# EAGLE design v2.1 (EAGLE 9.0.0)
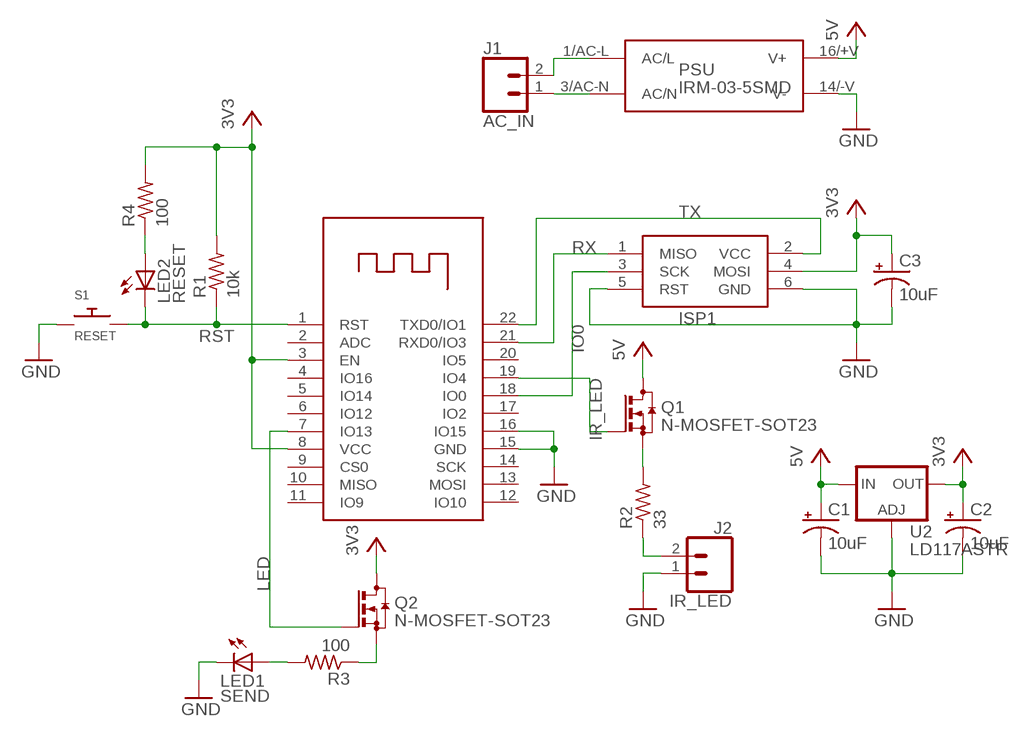
[diagram p0: schematic, sheet 1]

## Parts
C1  10uF  CPOL-US153CLV-0405  [153CLV-0405]
C2  10uF  CPOL-US153CLV-0405  [153CLV-0405]
C3  10uF  CPOL-US153CLV-0405  [153CLV-0405]
ISP1  AVRISP-6  [AVRISP]
J1  AC_IN  1X2_5MM_SCREW  [1X2_5MM_SCREW]
J2  IR_LED  1X2_5MM_SCREW  [1X2_5MM_SCREW]
LED1  SEND  LEDSML0805  [SML0805]
LED2  RESET  LEDSML0805  [SML0805]
PSU  IRM-03-5SMD  [IRM-03-5S]
Q1  N-MOSFET-SOT23  [SOT23]
Q2  N-MOSFET-SOT23  [SOT23]
R1  10k  R-US_R0805  [R0805]
R2  33  R-US_MELF0207R  [MINI_MELF-0207R]
R3  100  R-US_R0805  [R0805]
R4  100  R-US_R0805  [R0805]
S1  RESET  BUTTON  [B3F-1000]
U1  ESP-12F  [ESP-12F]
U2  LD117ASTR  [SOT223]

## Nets
3V3: C2.+ C3.+ ISP1.4(MOSI) Q2.3(D) R1.2 R4.2 U1.3(EN) U1.8(VCC) U2.4(OUT)
5V: C1.+ PSU.16/+V(V+) Q1.3(D) U2.3(IN)
AC/L: J1.2 PSU.1/AC-L(AC/L)
AC/N: J1.1 PSU.3/AC-N(AC/N)
GND: C1.- C2.- C3.- ISP1.5(RST) ISP1.6(GND) J2.1 LED1.C PSU.14/-V(V-) S1.1 S1.2 U1.15(GND) U1.16(IO15) U2.1(ADJ)
IO0: ISP1.3(SCK) U1.18(IO0)
IR_LED: Q1.1(G) U1.19(IO4)
LED: Q2.1(G) U1.7(IO13)
N$1: Q2.2(S) R3.1
N$2: LED1.A R3.2
N$3: LED2.A R4.1
N$5: Q1.2(S) R2.2
N$6: J2.2 R2.1
RST: LED2.C R1.1 S1.3 S1.4 U1.1(RST)
RX: ISP1.1(MISO) U1.21(RXD0/IO3)
TX: ISP1.2(VCC) U1.22(TXD0/IO1)
Unconnected: U1.2(ADC) U1.4(IO16) U1.5(IO14) U1.6(IO12) U1.9(CS0) U1.10(MISO) U1.11(IO9) U1.12(IO10) U1.13(MOSI) U1.14(SCK) U1.17(IO2) U1.20(IO5)

## Library data of the parts
C1-C3 = resistor:CPOL-US: POLARIZED CAPACITOR, American symbol
ISP1 = my_parts:AVRISP: AVR ISP HEADER Standard 6 pin header for AVR programming
J1 J2 = my_parts:1X2_5MM_SCREW
LED1 LED2 = led:LED: LED OSRAM: - CHIPLED LG R971, LG N971, LY N971, LG Q971, LY Q971, LO R971, LY R971 LH N974, LH R974 LS Q976, LO Q976, LY Q976 LO Q996 - Hyper CHIPLED LW Q18S LB Q993, LB Q99A, LB R99A - SideLED LS A670, LO A670, LY A670, LG A670, LP A670 LB A673, LV A673, LT A673, LW A673 LH A674 LY A675 LS A676, LA A676, LO A676, LY A676, LW A676 LS A679, LY A679, LG A679 - Hyper Micro SIDELED® LS Y876, LA Y876, LO Y876, LY Y876 LT Y87S - SmartLED LW L88C, LW L88S LB L89C, LB L89S, LG L890 LS L89K, LO L89K, LY L89K LS L896, LA L896, LO L896, LY L896 - TOPLED LS T670, LO T670, LY T670, LG T670, LP T670 LSG T670, LSP T670, LSY T670, LOP T670, LYG T670 LG T671, LOG T671, LSG T671 LB T673, LV T673, LT T673, LW T673 LH T674 LS T676, LA T676, LO T676, LY T676, LB T676, LH T676, LSB T676, LW T676 LB T67C, LV T67C, LT T67C, LS T67K, LO T67K, LY T67K, LW E67C LS E67B, LA E67B, LO E67B, LY E67B, LB E67C, LV E67C, LT E67C LW T67C LS T679, LY T679, LG T679 LS T770, LO T770, LY T770, LG T770, LP T770 LB T773, LV T773, LT T773, LW T773 LH T774 LS E675, LA E675, LY E675, LS T675 LS T776, LA T776, LO T776, LY T776, LB T776 LHGB T686 LT T68C, LB T68C - Hyper Mini TOPLED® LB M676 - Mini TOPLED Santana® LG M470 LS M47K, LO M47K, LY M47K Source: http://www.osram.convergy.de LUXEON: - LUMILED® LXK2-PW12-R00, LXK2-PW12-S00, LXK2-PW14-U00, LXK2-PW14-V00 LXK2-PM12-R00, LXK2-PM12-S00, LXK2-PM14-U00 LXK2-PE12-Q00, LXK2-PE12-R00, LXK2-PE12-S00, LXK2-PE14-T00, LXK2-PE14-U00 LXK2-PB12-K00, LXK2-PB12-L00, LXK2-PB12-M00, LXK2-PB14-N00, LXK2-PB14-P00, LXK2-PB14-Q00 LXK2-PR12-L00, LXK2-PR12-M00, LXK2-PR14-Q00, LXK2-PR14-R00 LXK2-PD12-Q00, LXK2-PD12-R00, LXK2-PD12-S00 LXK2-PH12-R00, LXK2-PH12-S00 LXK2-PL12-P00, LXK2-PL12-Q00, LXK2-PL12-R00 Source: www.luxeon.com KINGBRIGHT: KA-3528ASYC Source: www.kingbright.com
PSU = my_parts:IRM-03-5
Q1 Q2 = my_parts:N-MOSFET
R1-R4 = resistor:R-US_: RESISTOR, American symbol
S1 = my_parts:BUTTON
U1 = my_parts:ESP-12F
U2 = v-reg:LD117A?*: Low drop fixed and adjustable positive voltage regulators 1 A Source: http://www.st.com/stonline/products/literature/ds/7194/ld1117axx.pdf

## Board
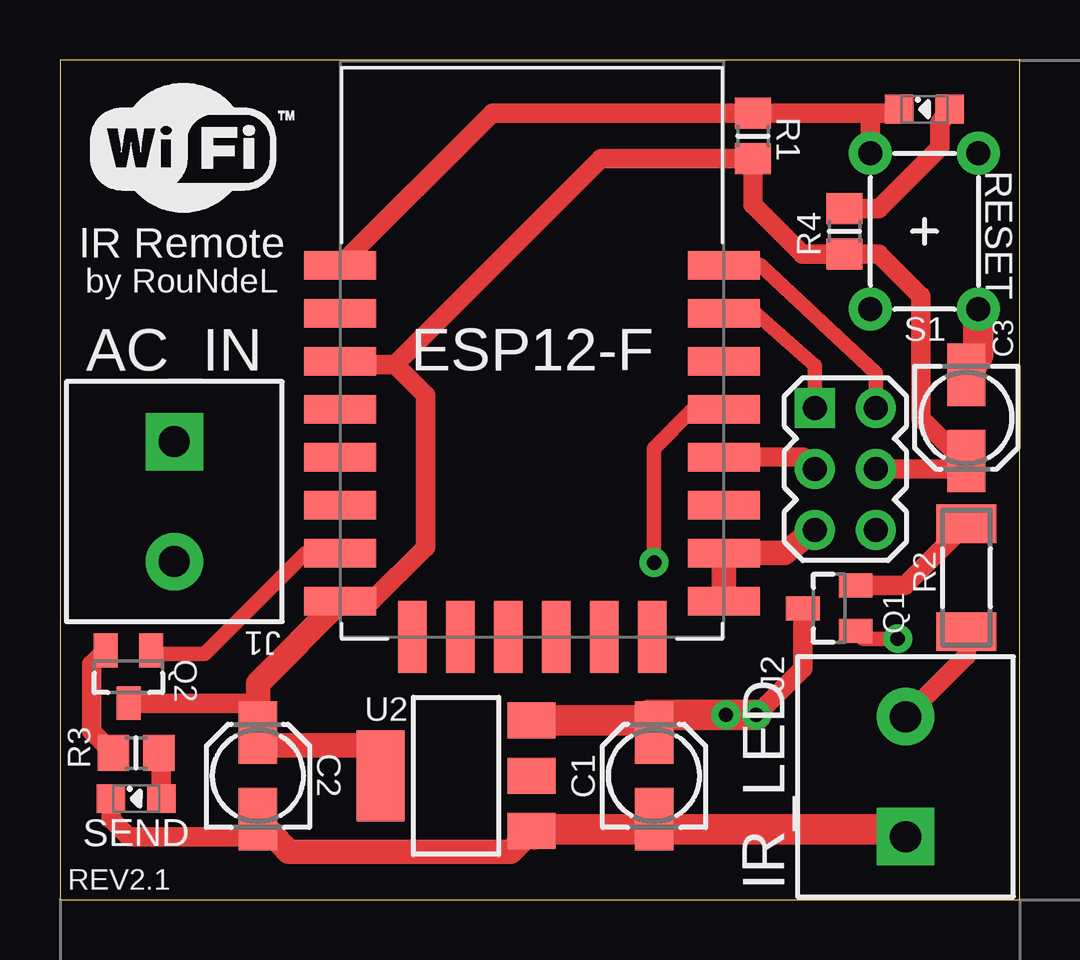
[diagram p1: board, top side]
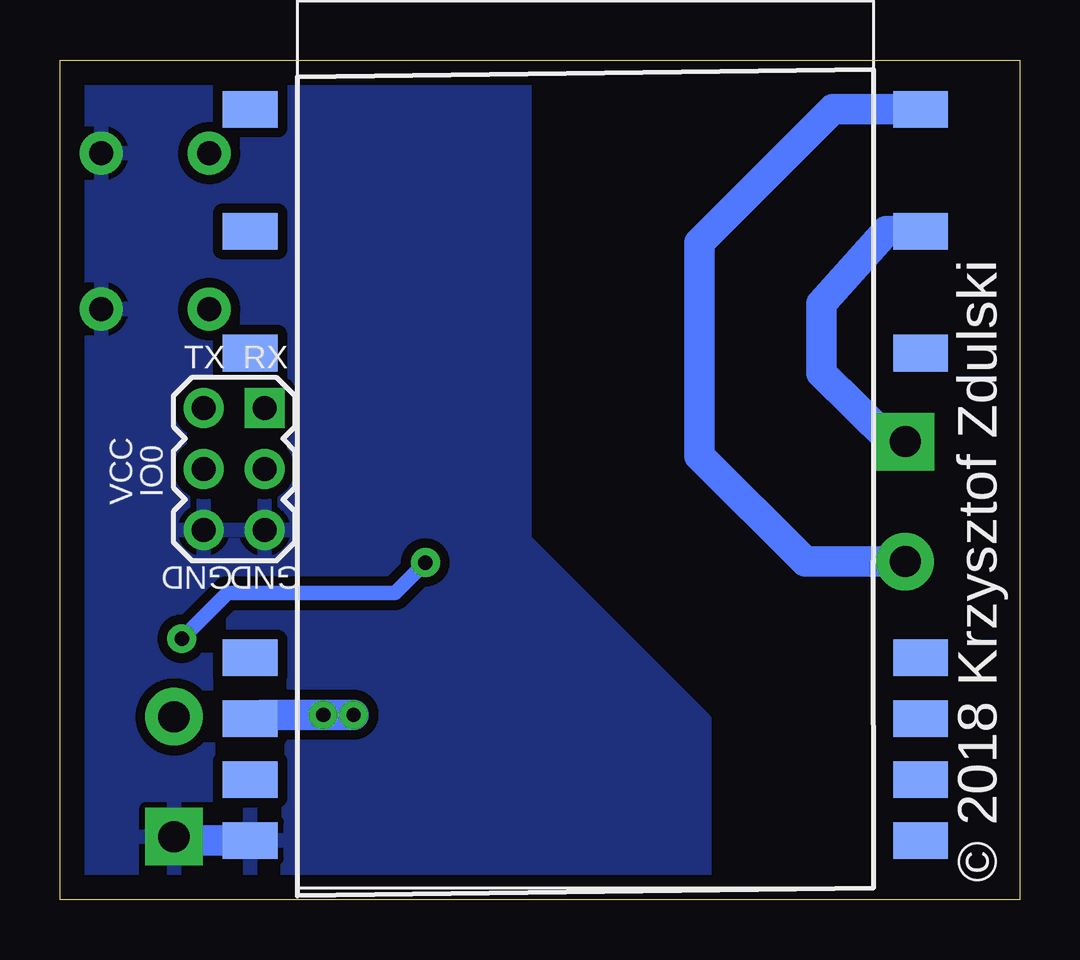
[diagram p2: board, bottom side, seen from below]

Size 40 x 35 mm. Coordinates in mm from the lower left corner, seen from the top.
Outline: 0,0 40,0 40,35 0,35 0,0
Copper layers (1*16): Top 0.035mm / dielectric 1.5mm / Bottom 0.035mm
Design rules "default *": minimum track width 6mil, minimum drill 0.35mm, track to track 6mil, track to pad 6mil, pad to pad 6mil, via to via 6mil, smd to smd 6mil, copper to edge 40mil, drill to drill 6mil, minimum pad ring 10mil, minimum via ring 8mil, stop-mask expansion 4mil, vias tented up to drill 0.6mm, thermal gap 10mil

### Footprints (pad centres in the part's own frame; a part is rotated, then mirrored left to right if it is on the bottom)
153CLV-0405 = smd 2.6 x 1.6: + 1.8,0; - -1.8,0
AVRISP = drill 1 pad 1.676 square: 1 -1.27,2.54 | drill 1 pad 1.676: 2 1.27,2.54; 3 -1.27,0; 4 1.27,0; 5 -1.27,-2.54; 6 1.27,-2.54
1X2_5MM_SCREW = drill 1.3 pad 2.4 square: 1 2.5,0 | drill 1.3 pad 2.4: 2 -2.5,0
SML0805 = smd 1.2 x 1.2: A 1.05,0; C -1.05,0
IRM-03-5S = smd 1.524 x 2.286: 1/AC-L -13.97,13.97; 3/AC-N -8.89,13.97; 5 -3.81,13.97; 10 8.89,13.97; 11 11.43,13.97; 12 13.97,13.97; 13 16.51,13.97; 14/-V 16.51,-13.97; 15 13.97,-13.97; 16/+V 11.43,-13.97; 17 8.89,-13.97; 22 -3.81,-13.97; 24 -8.89,-13.97; 26 -13.97,-13.97
SOT23 = smd 1 x 1.4: 1 -0.95,-1.1; 2 0.95,-1.1; 3 0,1.1
R0805 = smd 1.3 x 1.5: 1 -0.95,0; 2 0.95,0
MINI_MELF-0207R = smd 1.6 x 2.5: 1 -2.25,0; 2 2.25,0
B3F-1000 = drill 1 pad 1.778: 1 -3.25,2.25; 2 3.25,2.25; 3 -3.25,-2.25; 4 3.25,-2.25
ESP-12F = smd 3 x 1.2: 1 -8,3.5; 2 -8,1.5; 3 -8,-0.5; 4 -8,-2.5; 5 -8,-4.5; 6 -8,-6.5; 7 -8,-8.5; 8 -8,-10.5; 15 8,-10.5; 16 8,-8.5; 17 8,-6.5; 18 8,-4.5; 19 8,-2.5; 20 8,-0.5; 21 8,1.5; 22 8,3.5 | smd 1.2 x 3: 9 -5,-12; 10 -3,-12; 11 -1,-12; 12 1,-12; 13 3,-12; 14 5,-12
SOT223 = smd 1.5 x 2: 1 -2.3,-3.15; 2 0,-3.15; 3 2.3,-3.15 | smd 3.8 x 2: 4 0,3.15

### Placement (x,y rotation side)
C1  24.77,5.16 90 top
C2  8.26,5.16 90 top
C3  37.78,20.08 270 top
ISP1  32.74,17.95 0 top
J1  4.76,16.59 90 top
J2  35.25,5.12 270 top
LED1  3.17,4.21 0 top
LED2  36.03,32.94 0 top
PSU  18.1,18.97 270 bottom
Q1  32.07,12.14 90 top
Q2  2.86,9.29 180 top
R1  28.89,31.83 270 top
R2  37.78,13.41 90 top
R3  3.17,6.11 0 top
R4  32.7,27.86 270 top
S1  36.03,27.86 270 top
U1  19.68,22.94 0 top
U2  16.51,5.16 90 top

### Tracks (layer width: path | path; a pad name or v marks a point on that pad's centre or on a via)
3V3
  Top 0.61: 11.19,22.3 U1.3 | 34.38,17.95 ISP1.4 | 37.13,17.95 37.41,18.23 C3.+
  Top 0.813: 13.97,22.3 11.19,22.3 | U1.8 12.99,12.44 15.24,14.68 15.24,21.04 13.97,22.3 | ISP1.4 37.13,17.95 | 37.41,18.23 37.41,18.55 35.88,20.08 35.88,25.16 34.13,26.91 R4.2 30.96,26.91 28.89,28.97 R1.2 22.55,30.88 13.97,22.3 | Q2.3 7.77,8.19 8.26,7.38
  Top 1.016: U1.8 8.26,9.01 8.26,7.38 C2.+ 8.79,6.43 13.34,6.43 13.36,6.4 U2.4
5V  (via drill 0.6 pad 1.2)
  Top 0.813: v29.03,7.7 30.97,9.64 Q1.3
  Top 1.27: v29.03,7.7 v27.76,7.7 24.55,7.7 C1.+ 24.27,7.46 U2.3
  Bottom 0.813: 31.59,7.7 PSU.16/+V
  Bottom 1.27: v27.76,7.7 31.59,7.7
AC/L
  Bottom 1.27: PSU.1/AC-L 7.78,32.94 13.34,27.38 13.34,18.5 8.93,14.09 J1.2
AC/N
  Bottom 1.27: J1.1 5.36,19.09 5.4,19.13 8.26,21.95 8.26,24.84 5.55,27.86 PSU.3/AC-N
GND
  Top 0.813: LED1.C 2.12,3.35 2.86,2.62 7.95,2.62 8.47,3.13
  Top 1.016: U2.1 18.79,1.99 9.53,1.99 8.47,3.13 C2.- | 24.98,2.93 C1.- | U1.15 U1.16 30.19,14.44 ISP1.5
  Top 1.27: 19.8,2.72 U2.1 19.73,2.93 24.98,2.93 | C1.- 25.19,2.94 35.56,2.94 35.56,2.93 J2.1 | C3.- 38.28,22.7 S1.2
  Bottom 1.27: PSU.14/-V 35.09,2.46 J2.1
  pour Bottom (isolate 0.406): 40,0 13.13,0 13.13,7.5 20.64,15 20.64,35 40,35
IO0
  Top 0.813: ISP1.3 30.98,18.44 U1.18
IR_LED  (via drill 0.6 pad 1.2)
  Top 0.61: Q1.1 33.49,10.88 v34.92,10.88 | v24.77,14.05 24.77,18.81 26.39,20.44 U1.19
  Bottom 0.61: v34.92,10.88 33.02,12.78 26.04,12.78 v24.77,14.05
LED
  Top 0.61: U1.7 10.23,14.44 6.03,10.24 3.64,10.24 Q2.1
N$1
  Top 0.813: Q2.2 1.32,9.8 1.32,7.02 R3.1
N$2
  Top 0.61: 4.22,5.7 R3.2
  Top 0.813: LED1.A 4.22,5.7
N$3
  Top 0.813: R4.1 34.13,28.81 36.67,31.35 36.67,32.37 LED2.A
N$5
  Top 0.813: Q1.2 35.21,13.09 R2.2
N$6
  Top 0.813: R2.1 37.78,10.15 J2.2
RST
  Top 0.813: U1.1 18.02,32.78 R1.1 33.97,32.78 | LED2.C 34.82,32.78 33.97,32.78 | 33.97,32.78 33.78,32.59 S1.3
RX
  Top 0.61: ISP1.1 31.47,22.27 28.98,24.44 U1.21
TX
  Top 0.61: U1.22 29.2,26.44 34.01,21.95 ISP1.2

### Text on the board
_tplace: IR Remote | by RouNdeL | ESP12-F | REV2.1
_bplace: RX | TX | IO0 | VCC | GND | GND | © 2018 Krzysztof Zdulski